# EAGLE design anbisonique2 (EAGLE 7.6.0)
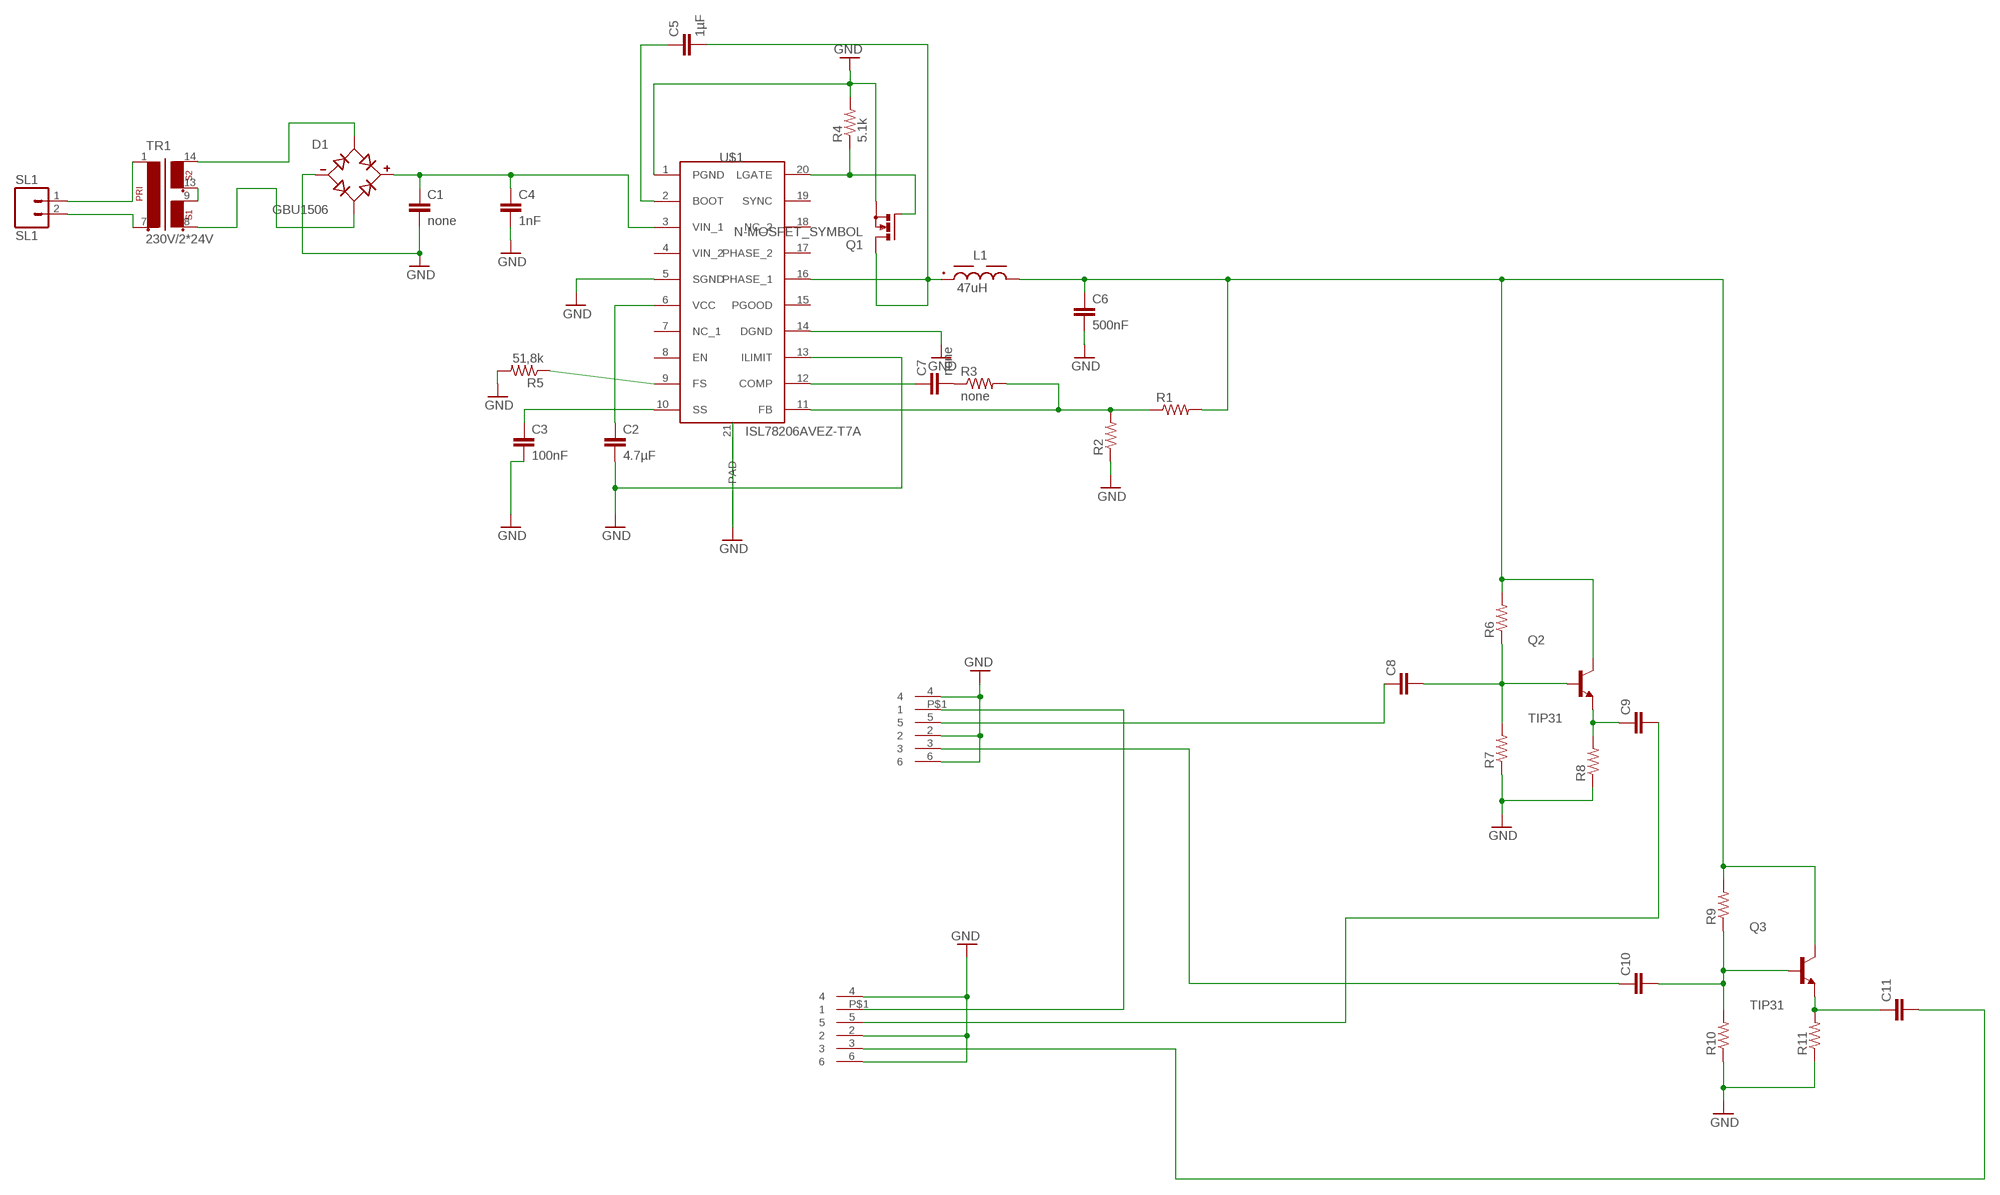
[diagram p0: schematic, sheet 1]

## Parts
C1  none  C-EUC0603  [C0603]
C2  4.7µF  C-EUC0603  [C0603]
C3  100nF  C-EUC0603  [C0603]
C4  1nF  C-EUC0603  [C0603]
C5  1µF  C-EUC0603  [C0603]
C6  500nF  C-EUC0603  [C0603]
C7  none  C-EUC0603  [C0603]
C8  C-EUC0603  [C0603]
C9  C-EUC0603  [C0603]
C10  C-EUC0603  [C0603]
C11  C-EUC0603  [C0603]
D1  GBU1506  [SIP343W114P508L2205H2134Q4]
L1  47uH  WE-PDA_1210_7847709470  [WE-PDA_1210]
Q2  TIP31  [TO254P1060X482X2222-3]
Q3  TIP31  [TO254P1060X482X2222-3]
R1  R-US_R0603  [R0603]
R2  R-US_R0603  [R0603]
R3  none  R-US_R0603  [R0603]
R4  5.1k  R-US_R0603  [R0603]
R5  51,8k  R-US_R0603  [R0603]
R6  R-US_R0603  [R0603]
R7  R-US_R0603  [R0603]
R8  R-US_R0603  [R0603]
R9  R-US_R0603  [R0603]
R10  R-US_R0603  [R0603]
R11  R-US_R0603  [R0603]
SL1  SL1  M02  [02P]
TR1  230V/2*24V  EI60-2  [EI60-2]
U$1  ISL78206AVEZ-T7A  [SOP65P640X110-21N]
U$2  JACK6.35MMRSPRODEV  [JACKRSPRO6.35MM]
U$3  JACK6.35MMRSPRODEV  [JACKRSPRO6.35MM]

## Nets
GND: C1.2 C2.2 C3.2 C4.2 C6.2 D1.- R2.1 R4.2 R5.2 R7.1 R8.1 R10.1 R11.1 U$1.1(PGND) U$1.5(SGND) U$1.13(ILIMIT) U$1.14(DGND) U$1.21(PAD) U$2.2 U$2.4 U$2.6 U$3.2 U$3.4 U$3.6
N$1: TR1.9 TR1.13
N$2: D1.AC1 TR1.14
N$3: C2.1 U$1.6(VCC)
N$4: SL1.1 TR1.1
N$5: SL1.2 TR1.7
N$6: D1.AC2 TR1.8
N$7: U$2.P$1 U$3.P$1
N$8: C1.1 C4.1 D1.+ U$1.3(VIN_1)
N$9: C3.1 U$1.10(SS)
N$10: C5.1 U$1.2(BOOT)
N$11: C10.2 Q3.1(B) R9.1 R10.2
N$12: C9.1 Q2.3(E) R8.2
N$13: R1.1 R2.2 R3.2 U$1.11(FB)
N$14: C7.1 U$1.12(COMP)
N$15: C7.2 R3.1
N$16: R5.1 U$1.9(FS)
N$17: R4.1 U$1.20(LGATE)
N$18: C8.2 Q2.1(B) R6.1 R7.2
N$19: C9.2 U$3.5
N$20: C11.1 Q3.3(E) R11.2
N$21: C6.1 L1.2 Q2.2(C) Q3.2(C) R1.2 R6.2 R9.2
N$22: C5.2 L1.1 U$1.16(PHASE_1)
N$23: C11.2 U$3.3
N$24: C10.1 U$2.3
N$25: C8.1 U$2.5
Unconnected: U$1.4(VIN_2) U$1.7(NC_1) U$1.8(EN) U$1.15(PGOOD) U$1.17(PHASE_2) U$1.18(NC_2) U$1.19(SYNC)

## Library data of the parts
C1-C11 = rcl:C-EU: CAPACITOR, European symbol
D1 = GBU1506:GBU1506: Check availability <https://pricing.snapeda.com/parts/GBU1506/Taiwan%20Semiconductor%20Corporation/view-part?ref=eda>; AVAILABILITY: In Stock; DESCRIPTION: 15A, 800V, Standard Bridge Rectifier; MF: Taiwan Semiconductor Corporation; MP: GBU1506; PACKAGE: GBU Taiwan Semiconductor; PRICE: None
L1 = Eagle_WE-PDA (rev20b):WE-PDA_1210: WE-PDA SMD Shielded Power Inductor Characteristics Magnetically shielded version which results in a low leakage field High storage capacity High Saturation currents up to 23 A Very low self-losses at high switching frequency's Wide inductance spectrum available at all sizes Operating Temperature -40 °C up to +125 °C Core Material: NiZn Wire connection: welding technology Applications Multimedia applications Switching regulators with low operating voltages Integrated DC/DC-converter Perfect suitable for switching regulators with extremely high efficiency (> 86 %) Plastic base: Because of the one piece construction these are more suitable for high vibration or shock applications <https://www.we-online.com/catalog/media/o55118v209%20Family_WE-PDA.jpg> Details see: https://www.we-online.com/katalog/en/WE-PDA Updated by Ella Wu 2020-03-18 2020(C) Wurth Elektronik; DATASHEET-URL: https://www.we-online.com/catalog/datasheet/7847709470.pdf; FRES: 6.3MHz; IR: 3.2A; ISAT: 3.5A; MOUNT: SMT; PART-NUMBER: 7847709470; RDC-MAX: 67mOhm; RDC-TYP: 56mOhm
Q2 Q3 = TIP31:TIP31: Bipolar (BJT) Transistor NPN 40V 3A 3MHz 2W Through Hole TO-220AB Check availability <https://pricing.snapeda.com/parts/TIP31/ON/view-part?ref=eda>; AVAILABILITY: In Stock; DESCRIPTION: Bipolar (BJT) Transistor NPN 100 V 3 A 3MHz 2 W Through Hole TO-220; MF: ON; MP: TIP31; PACKAGE: TO-220-3 ON Semiconductor; PRICE: None; PURCHASE-URL: https://pricing.snapeda.com/search/part/TIP31/?ref=eda
R1-R11 = rcl:R-US_: RESISTOR, American symbol
SL1 = con-amp-quick:M02: AMP QUICK CONNECTOR; OC_FARNELL: unknown; OC_NEWARK: unknown
TR1 = trafo:EI60-2: TRANSFORMER 1 primary winding, 2 secondary windings, mounting holes ERA
U$1 = SOP65P640X110-21N:ISL78206AVEZ-T7A
U$2 U$3 = jackRSpro6.35mm:JACK6.35MMRSPRODEV

## Board
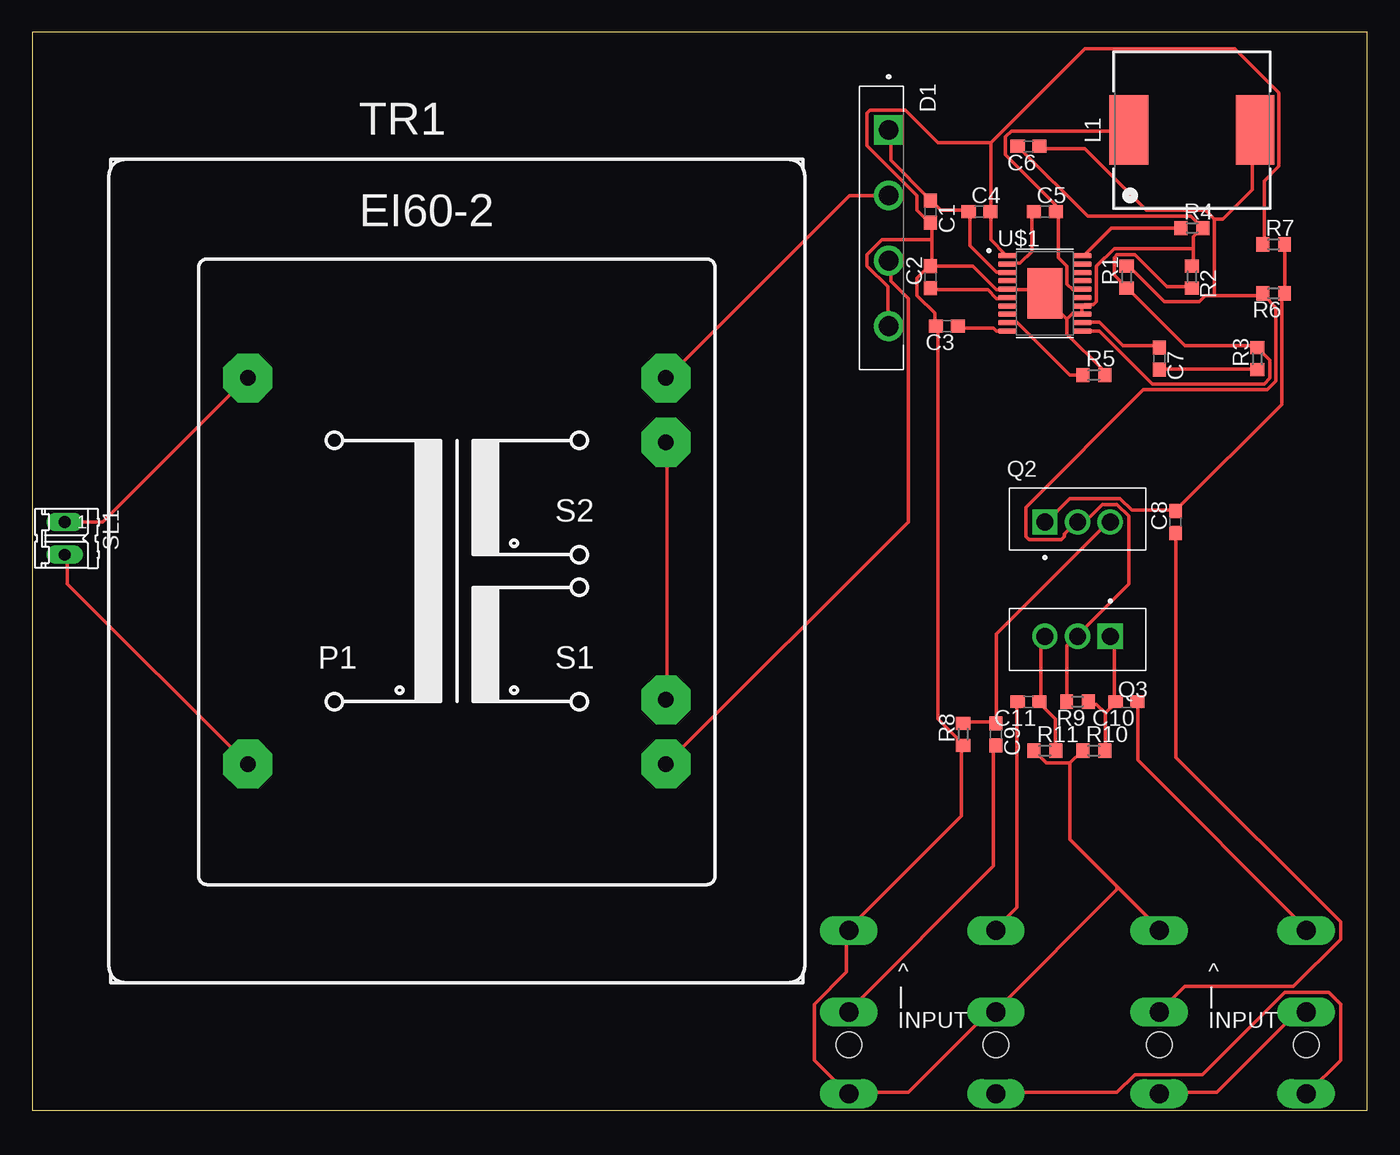
[diagram p1: board, top side]
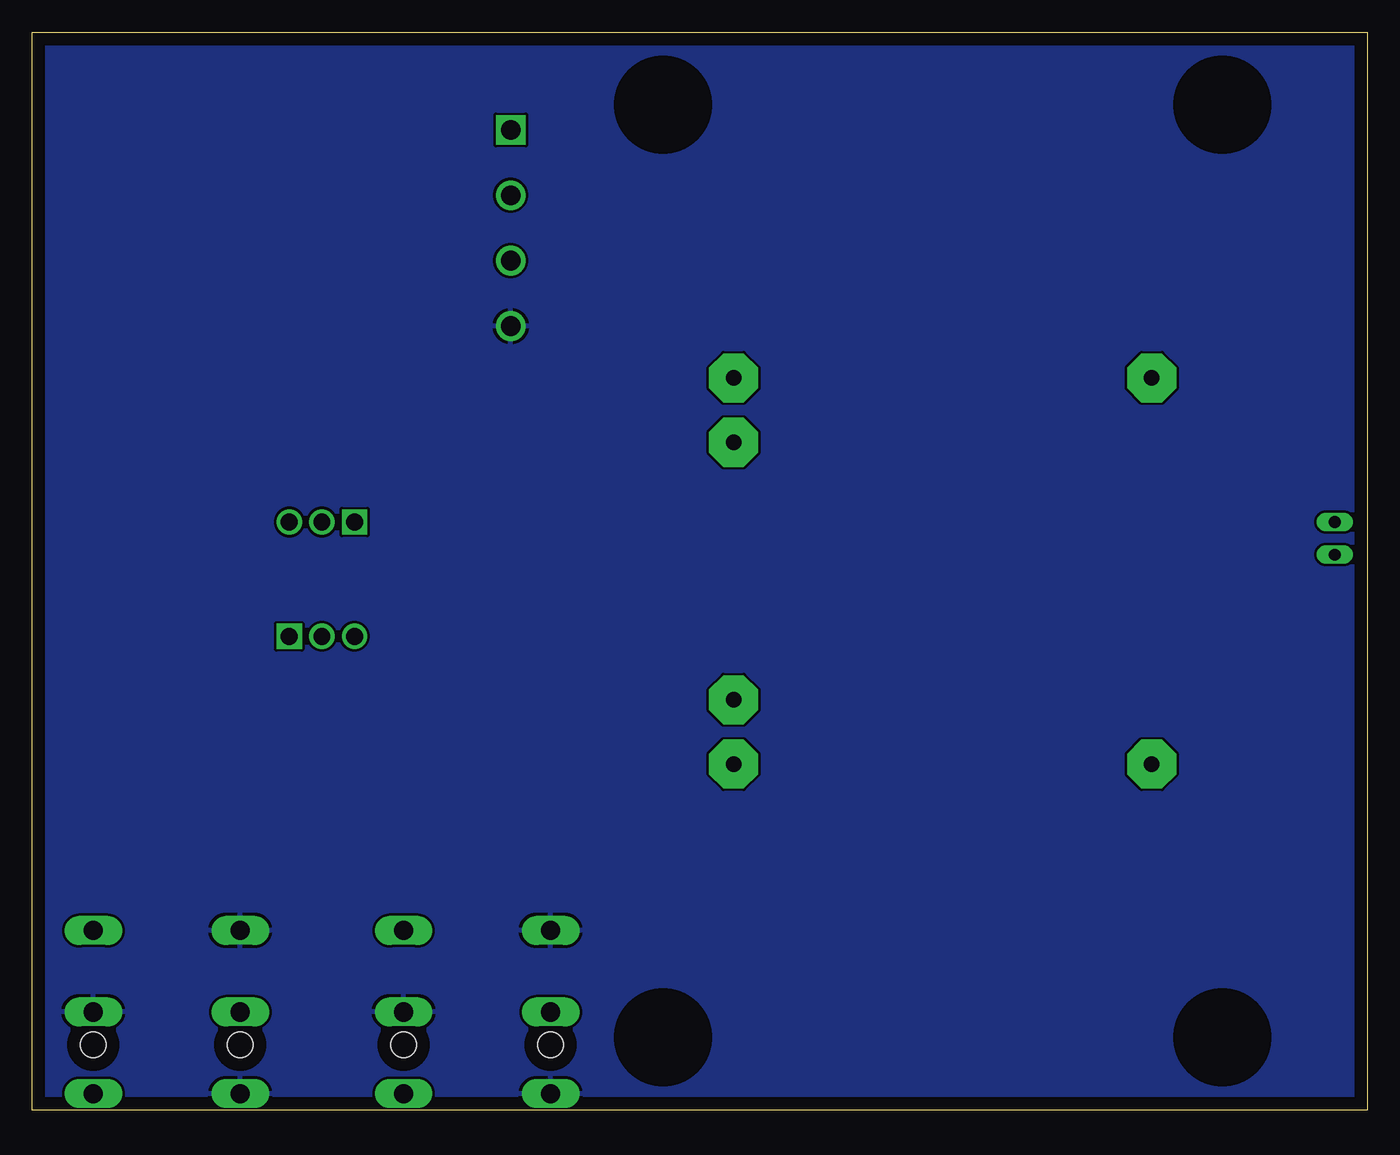
[diagram p2: board, bottom side, seen from below]

Size 103.81 x 83.81 mm. Coordinates in mm from the lower left corner, seen from the top.
Outline: 0,0 103.81,0 103.81,83.81 0,83.81 0,0
Copper layers (1*16): Top 0.035mm / dielectric 1.5mm / Bottom 0.035mm
Design rules "default": minimum track width 10mil, minimum drill 24mil, track to track 8mil, track to pad 8mil, pad to pad 8mil, via to via 8mil, smd to smd 8mil, copper to edge 40mil, drill to drill 8mil, minimum pad ring 10mil, minimum via ring 8mil, stop-mask expansion 4mil, vias tented up to drill 0mil, thermal gap 10mil

### Footprints (pad centres in the part's own frame; a part is rotated, then mirrored left to right if it is on the bottom)
C0603 = smd 1.1 x 1: 1 -0.85,0; 2 0.85,0
SIP343W114P508L2205H2134Q4 = drill 1.54 square: + -7.62,0.56 | drill 1.54: - 7.62,0.56; AC1 -2.54,0.56; AC2 2.54,0.56
WE-PDA_1210 = smd 5.4 x 3: 1 0,4.9; 2 0,-4.9
TO254P1060X482X2222-3 = drill 1.31 square: 1 -2.54,0 | drill 1.31: 2 0,0; 3 2.54,0
R0603 = smd 1 x 1.1: 1 -0.85,0; 2 0.85,0
02P = drill 0.914 long: 1 -1.27,0; 2 1.27,0
EI60-2 = drill 1.194 pad 3.81 octagon: 1 -16.256,15.011; 7 -16.256,-15.011; 8 16.256,-15.011; 9 16.256,-10.008; 13 16.256,10.008; 14 16.256,15.011
SOP65P640X110-21N = smd 1.46 x 0.41: 1 -2.885,2.925; 2 -2.885,2.275; 3 -2.885,1.625; 4 -2.885,0.975; 5 -2.885,0.325; 6 -2.885,-0.325; 7 -2.885,-0.975; 8 -2.885,-1.625; 9 -2.885,-2.275; 10 -2.885,-2.925; 11 2.885,-2.925; 12 2.885,-2.275; 13 2.885,-1.625; 14 2.885,-0.975; 15 2.885,-0.325; 16 2.885,0.325; 17 2.885,0.975; 18 2.885,1.625; 19 2.885,2.275; 20 2.885,2.925 | smd 2.743 x 3.937: 21 0,0
JACKRSPRO6.35MM = drill 1.5 long: 2 -2.54,2.54; 3 -8.89,2.54; 4 3.81,-8.89; 5 -2.54,-8.89; 6 -8.89,-8.89; P$1 3.81,2.54 | hole 2: 0,2.54; 0,-8.89

### Placement (x,y rotation side)
C1  69.85,69.85 270 top
C2  69.85,64.77 90 top
C3  71.12,60.96 180 top
C4  73.66,69.85 0 top
C5  78.74,69.85 0 top
C6  77.47,74.93 180 top
C7  87.63,58.42 270 top
C8  88.9,45.72 90 top
C9  74.93,29.21 270 top
C10  85.09,31.75 180 top
C11  77.47,31.75 180 top
D1  66.04,68.58 270 top
L1  90.17,76.2 90 top
Q2  81.28,45.72 0 top
Q3  81.28,36.83 180 top
R1  85.09,64.77 90 top
R2  90.17,64.77 270 top
R3  95.25,58.42 90 top
R4  90.17,68.58 0 top
R5  82.55,57.15 0 top
R6  96.52,63.5 180 top
R7  96.52,67.31 0 top
R8  72.39,29.21 90 top
R9  81.28,31.75 180 top
R10  82.55,27.94 0 top
R11  78.74,27.94 0 top
SL1  2.54,44.45 270 top
TR1  33.02,41.91 0 top
U$1  78.74,63.5 0 top
U$2  96.52,5.08 270 top
U$3  72.39,5.08 270 top

### Tracks (layer width: path | path; a pad name or v marks a point on that pad's centre or on a via)
GND
  Top 0.254: U$1.1 75.67,66.52 74.52,67.67 74.52,69.72 C4.2 74.52,69.95 74.52,75.21 | 74.52,75.21 81.84,82.53 93.5,82.53 96.93,79.1 96.93,73.38 95.78,72.24 95.78,67.44 R7.1 | 90.3,66.98 90.3,67.89 90.98,68.58 | 90.3,66.98 90.3,65.84 R2.1 | 90.98,68.58 90.07,69.49 82.07,69.49 76.81,74.75 C6.2 | 90.98,68.58 R4.2 | 69.95,67.67 69.95,68.81 C1.2 69.72,69.04 68.81,69.95 68.81,71.09 64.92,74.98 64.92,77.5 65.15,77.72 67.89,77.72 70.41,75.21 74.52,75.21 | 69.95,67.67 69.95,65.84 C2.2 | C2.2 69.72,65.61 68.81,64.69 68.81,63.32 70.18,61.95 70.18,61.04 C3.2 70.41,60.81 70.41,30.4 72.24,28.57 R8.1 72.24,28.35 72.24,22.86 63.55,14.17 U$3.6 63.32,13.95 63.32,10.74 60.81,8.23 60.81,3.89 63.32,1.37 U$3.4 63.55,1.37 68.12,1.37 74.3,7.54 74.75,7.54 U$3.2 74.98,7.77 84.35,17.14 84.35,17.37 | 80.47,61.49 80.47,60.35 83.21,57.61 83.21,57.15 R5.2 | 80.47,61.49 80.92,61.95 81.61,61.95 | 81.61,61.95 81.61,62.41 U$1.14 81.84,62.64 82.53,62.64 82.75,62.87 82.75,65.61 84.12,66.98 90.3,66.98 | 81.61,61.95 U$1.13 | 80.47,61.49 78.64,63.32 U$1.21 78.64,63.55 78.41,63.78 75.89,63.78 U$1.5 75.67,63.78 74.98,63.78 73.15,65.61 69.95,65.61 C2.2 | 69.95,67.67 66.06,67.67 64.92,66.52 64.92,65.61 66.52,64.01 66.52,61.04 D1.- | 80.7,26.98 78.87,26.98 77.95,27.89 R11.1 | 80.7,26.98 81.61,27.89 R10.1 | 80.7,26.98 80.7,21.03 84.35,17.37 | 84.35,17.37 87.55,14.17 U$2.6 | U$2.4 87.78,1.37 92.13,1.37 98.3,7.54 98.98,7.54 U$2.2
  pour Bottom: 0,0 0,83.82 104.14,83.82 104.14,0
N$1
  Top 0.254: TR1.9 49.38,32 49.38,51.89 TR1.13
N$2
  Top 0.254: D1.AC1 66.52,71.09 63.55,71.09 49.38,56.92 TR1.14
N$3
  Top 0.254: C2.1 69.95,63.78 74.3,63.78 74.98,63.09 75.67,63.09 U$1.6
N$4
  Top 0.254: SL1.1 5.49,45.72 16.69,56.92 TR1.1
N$5
  Top 0.254: TR1.7 2.74,40.92 2.74,42.98 SL1.2
N$6
  Top 0.254: D1.AC2 66.75,65.84 66.75,64.47 68.12,63.09 68.12,45.72 49.38,26.98 TR1.8
N$7
  Top 0.254: U$3.P$1 74.98,1.37 84.35,1.37 85.72,2.74 90.98,2.74 97.38,9.14 100.81,9.14 101.73,8.23 101.73,3.89 99.21,1.37 U$2.P$1
N$8
  Top 0.254: U$1.3 75.67,65.15 74.98,65.15 72.92,67.21 72.92,69.72 C4.1 72.69,69.95 70.64,69.95 69.95,70.64 C1.1 69.72,70.87 66.75,73.84 66.75,76.12 D1.+
N$9
  Top 0.254: C3.1 72.01,60.81 74.75,60.81 74.98,60.58 75.67,60.58 U$1.10
N$10
  Top 0.254: C5.1 77.72,69.72 77.72,66.75 76.81,65.84 75.89,65.84 U$1.2
N$11
  Top 0.254: 83.44,30.86 83.44,28.12 R10.2 | 83.44,30.86 84.12,31.55 C10.2 84.12,31.77 84.12,36.58 83.9,36.8 Q3.1 | 83.44,30.86 82.75,31.55 82.3,31.55 R9.1
N$12
  Top 0.254: R8.2 72.47,30.18 74.75,30.18 C9.1 74.98,30.18 74.98,37.03 83.67,45.72 Q2.3
N$13
  Top 0.254: R2.2 90.07,64.01 88.24,64.01 85.72,66.52 84.35,66.52 84.12,66.29 84.12,64.92 85.04,64.01 R1.1 85.27,63.78 89.61,59.44 95.1,59.44 R3.2 95.33,59.21 96.24,58.29 96.24,56.92 95.78,56.46 87.1,56.46 82.98,60.58 81.84,60.58 U$1.11
N$14
  Top 0.254: C7.1 87.55,59.44 84.81,59.44 82.98,61.27 81.84,61.27 U$1.12
N$15
  Top 0.254: C7.2 87.78,57.61 95.1,57.61 R3.1
N$16
  Top 0.254: R5.1 80.7,57.15 76.58,61.27 75.89,61.27 U$1.9
N$17
  Top 0.254: R4.1 83.9,68.58 81.84,66.52 U$1.20
N$18
  Top 0.254: R7.2 97.38,67.21 97.38,63.55 R6.1 97.16,63.32 97.16,54.86 88.92,46.63 C8.2 88.7,46.63 85.5,46.63 84.58,47.55 80.7,47.55 78.87,45.72 Q2.1
N$19
  Top 0.254: C9.2 74.75,28.35 74.75,18.97 63.55,7.77 U$3.5
N$20
  Top 0.254: R11.2 79.55,28.12 79.55,30.4 78.41,31.55 C11.1 78.41,31.77 78.41,36.58 78.64,36.8 Q3.3
N$21
  Top 0.254: R9.2 80.47,31.77 80.47,36.12 81.15,36.8 Q3.2 81.38,37.03 85.27,40.92 85.27,46.18 84.35,47.09 83.21,47.09 81.84,45.72 Q2.2 81.15,45.72 80.24,44.81 80.24,44.58 80.01,44.35 77.5,44.35 77.27,44.58 77.27,46.86 86.41,56.01 96.01,56.01 96.7,56.69 96.7,62.41 95.78,63.32 R6.2 95.56,63.32 91.9,63.32 | 91.9,63.32 91.21,63.32 90.75,62.87 88.01,62.87 85.27,65.61 R1.2 | 91.9,69.27 91.21,69.95 86.64,69.95 81.84,74.75 78.41,74.75 C6.1 | 91.9,63.32 91.9,69.27 | 91.9,69.27 92.58,69.27 94.87,71.55 94.87,76.12 L1.2
N$22
  Top 0.254: U$1.16 81.61,63.78 80.92,63.78 80.47,64.24 80.47,65.61 79.78,66.29 79.78,69.72 C5.2 79.55,69.95 79.55,70.41 75.67,74.3 75.67,75.67 76.12,76.12 85.27,76.12 L1.1
N$23
  Top 0.254: C11.2 76.58,31.55 76.58,15.77 74.98,14.17 U$3.3
N$24
  Top 0.254: C10.1 85.95,31.55 85.95,27.2 98.98,14.17 U$2.3
N$25
  Top 0.254: U$2.5 89.61,9.6 98.07,9.6 101.73,13.26 101.73,14.63 88.92,27.43 88.92,44.81 C8.1